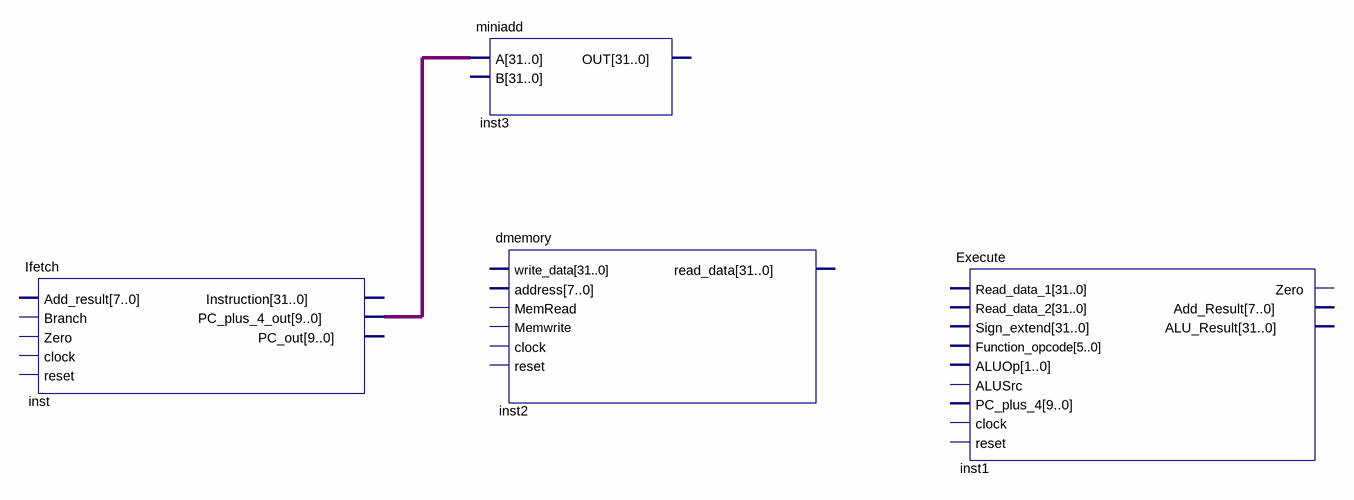
[diagram p0: schematic sheet]
// Quartus schematic project1.bdf as structural Verilog: 4 symbols, 0 pins
module project1 (
);

  wire [31:0] inst_pc_plus_4_out;

  Ifetch inst (.PC_plus_4_out(inst_pc_plus_4_out));  // open: Add_result, Branch, Zero, clock, reset, Instruction, PC_out
  miniadd inst3 (.A(inst_pc_plus_4_out));  // open: B, OUT
  dmemory inst2 ();  // open: write_data, address, MemRead, Memwrite, clock, reset, read_data
  Execute inst1 ();  // open: Read_data_1, Read_data_2, Sign_extend, Function_opcode, ALUOp, ALUSrc, PC_plus_4, clock, reset, Zero, Add_Result, ALU_Result
endmodule
